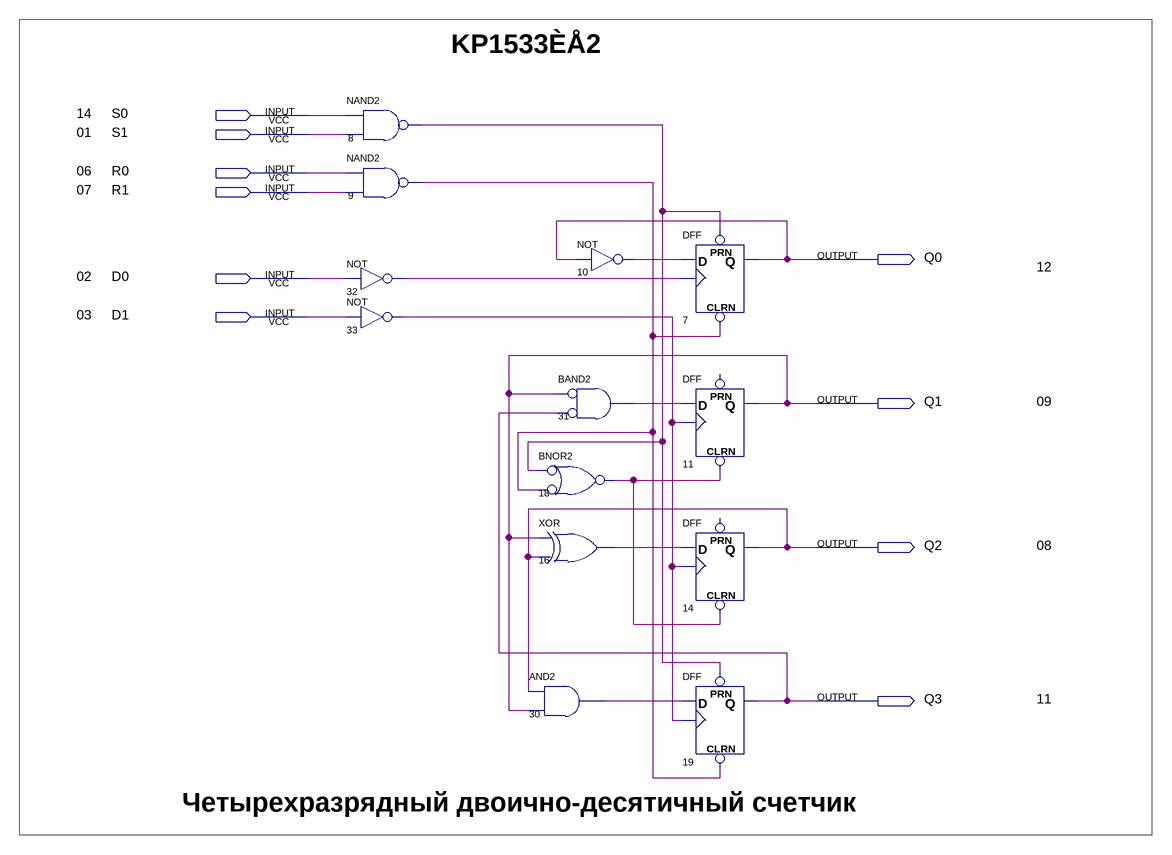
[diagram p0: schematic sheet]
// Quartus schematic KP1533IE2.bdf as structural Verilog: 13 symbols, 10 pins
module KP1533IE2 (
  input  S0,
  input  S1,
  input  R0,
  input  R1,
  input  D0,
  input  D1,
  output Q0,
  output Q1,
  output Q2,
  output Q3
);

  wire n8_out, n9_out, n10_out, n16_out, n18_out, n30_out, n31_out, n32_out, n33_out;

  nand u_8 (n8_out, S0, S1);
  nand u_9 (n9_out, R0, R1);
  not u_32 (n32_out, D0);
  not u_33 (n33_out, D1);
  nor u_18 (n18_out, ~n8_out, ~n9_out);  // BNOR2
  xor u_16 (n16_out, Q1, Q2);
  and u_30 (n30_out, Q2, Q1);
  not u_10 (n10_out, Q0);
  and u_31 (n31_out, ~Q1, ~Q3);  // BAND2
  DFF u_7 (.CLRN(n9_out), .CLK(n32_out), .D(n10_out), .PRN(n8_out), .Q(Q0));
  DFF u_11 (.CLRN(n18_out), .CLK(n33_out), .D(n31_out), .Q(Q1));  // open: PRN
  DFF u_14 (.CLRN(n18_out), .CLK(n33_out), .D(n16_out), .Q(Q2));  // open: PRN
  DFF u_19 (.CLRN(n9_out), .CLK(n33_out), .D(n30_out), .PRN(n8_out), .Q(Q3));

  // Notes on the sheet:
  //   KP1533ÈÅ2
  //   14
  //   01
  //   06
  //   07
  //   12
  //   02
  //   03
  //   09
  //   08
  //   11
  //   Четырехразрядный двоично-десятичный счетчик
endmodule
